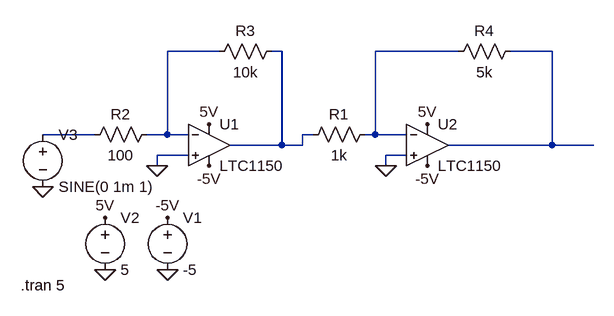
[diagram p0: schematic Cascading_Amplifier.asc]
Cascading_Amplifier.asc, the LTspice schematic file:
Version 4
SHEET 1 880 680
WIRE 64 -16 -16 -16
WIRE 160 -16 144 -16
WIRE 432 -16 304 -16
WIRE 576 -16 512 -16
WIRE -128 112 -208 112
WIRE -16 112 -16 -16
WIRE -16 112 -48 112
WIRE 16 112 -16 112
WIRE 208 112 192 112
WIRE 304 112 304 -16
WIRE 304 112 288 112
WIRE 352 112 304 112
WIRE 160 128 160 -16
WIRE 160 128 80 128
WIRE 192 128 192 112
WIRE 192 128 160 128
WIRE 576 128 576 -16
WIRE 576 128 416 128
WIRE 640 128 576 128
WIRE 16 144 -32 144
WIRE 352 144 320 144
WIRE -32 160 -32 144
WIRE 320 160 320 144
FLAG -112 320 0
FLAG -16 320 0
FLAG -112 240 5V
FLAG 48 96 5V
FLAG 384 96 5V
FLAG -16 240 -5V
FLAG 48 160 -5V
FLAG 384 160 -5V
FLAG 320 160 0
FLAG -32 160 0
FLAG -208 192 0
SYMBOL OpAmps\\LTC1150 48 64 R0
SYMATTR InstName U1
SYMBOL OpAmps\\LTC1150 384 64 R0
SYMATTR InstName U2
SYMBOL voltage -16 224 R0
WINDOW 123 0 0 Left 0
WINDOW 39 0 0 Left 0
SYMATTR InstName V1
SYMATTR Value -5
SYMBOL voltage -112 224 R0
WINDOW 123 0 0 Left 0
WINDOW 39 0 0 Left 0
SYMATTR InstName V2
SYMATTR Value 5
SYMBOL res 304 96 R90
WINDOW 0 0 56 VBottom 2
WINDOW 3 32 56 VTop 2
SYMATTR InstName R1
SYMATTR Value 1k
SYMBOL res -32 96 R90
WINDOW 0 0 56 VBottom 2
WINDOW 3 32 56 VTop 2
SYMATTR InstName R2
SYMATTR Value 100
SYMBOL res 160 -32 R90
WINDOW 0 0 56 VBottom 2
WINDOW 3 32 56 VTop 2
SYMATTR InstName R3
SYMATTR Value 10k
SYMBOL res 528 -32 R90
WINDOW 0 0 56 VBottom 2
WINDOW 3 32 56 VTop 2
SYMATTR InstName R4
SYMATTR Value 5k
SYMBOL voltage -208 96 R0
WINDOW 123 0 0 Left 0
WINDOW 39 0 0 Left 0
SYMATTR InstName V3
SYMATTR Value SINE(0 1m 1)
TEXT -242 344 Left 2 !.tran 5

The netlist it stands for:
* Cascading_Amplifier.asc
XU1 0 N001 5V -5V N002 LTC1150  ; pins In+ In- V+ V- OUT
XU2 0 N003 5V -5V N004 LTC1150  ; pins In+ In- V+ V- OUT
V1 -5V 0 -5
V2 5V 0 5
R1 N003 N002 1k
R2 N001 N005 100
R3 N002 N001 10k
R4 N004 N003 5k
V3 N005 0 SINE(0 1m 1)
.tran 5
.lib LTC.lib
.backanno
.end